# EAGLE design CH340E-noUSB (EAGLE 9.6.2)
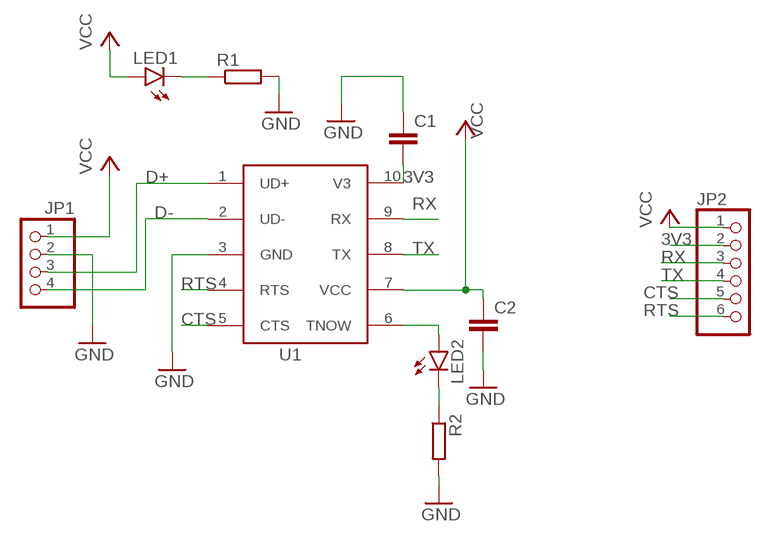
[diagram p0: schematic, sheet 1]

## Parts
C1  C-EUC0603  [C0603]
C2  C-EUC0603  [C0603]
JP1  PINHD-1X4  [1X04]
JP2  PINHD-1X6/90  [1X06/90]
LED1  LEDCHIP-LED0603  [CHIP-LED0603]
LED2  LEDCHIP-LED0603  [CHIP-LED0603]
R1  R-EU_R0603  [R0603]
R2  R-EU_R0603  [R0603]
U1  CH340ESMD  [MSOP10]

## Nets
3V3: C1.2 JP2.2 U1.10(V3)
CTS: JP2.5 U1.5(CTS)
D+: JP1.3 U1.1(UD+)
D-: JP1.4 U1.2(UD-)
GND: C1.1 C2.2 JP1.2 R1.2 R2.2 U1.3(GND)
N$2: LED1.C R1.1
N$3: LED2.A U1.6(TNOW)
N$4: LED2.C R2.1
RTS: JP2.6 U1.4(RTS)
RX: JP2.3 U1.9(RX)
TX: JP2.4 U1.8(TX)
VCC: C2.1 JP1.1 JP2.1 LED1.A U1.7(VCC)

## Library data of the parts
C1 C2 = rcl:C-EU: CAPACITOR, European symbol; SPICEPREFIX: C
JP1 = pinhead:PINHD-1X4: PIN HEADER
JP2 = pinhead:PINHD-1X6: PIN HEADER
LED1 LED2 = led:LED: LED OSRAM: - CHIPLED LG R971, LG N971, LY N971, LG Q971, LY Q971, LO R971, LY R971 LH N974, LH R974 LS Q976, LO Q976, LY Q976 LO Q996 - Hyper CHIPLED LW Q18S LB Q993, LB Q99A, LB R99A - SideLED LS A670, LO A670, LY A670, LG A670, LP A670 LB A673, LV A673, LT A673, LW A673 LH A674 LY A675 LS A676, LA A676, LO A676, LY A676, LW A676 LS A679, LY A679, LG A679 - Hyper Micro SIDELED® LS Y876, LA Y876, LO Y876, LY Y876 LT Y87S - SmartLED LW L88C, LW L88S LB L89C, LB L89S, LG L890 LS L89K, LO L89K, LY L89K LS L896, LA L896, LO L896, LY L896 - TOPLED LS T670, LO T670, LY T670, LG T670, LP T670 LSG T670, LSP T670, LSY T670, LOP T670, LYG T670 LG T671, LOG T671, LSG T671 LB T673, LV T673, LT T673, LW T673 LH T674 LS T676, LA T676, LO T676, LY T676, LB T676, LH T676, LSB T676, LW T676 LB T67C, LV T67C, LT T67C, LS T67K, LO T67K, LY T67K, LW E67C LS E67B, LA E67B, LO E67B, LY E67B, LB E67C, LV E67C, LT E67C LW T67C LS T679, LY T679, LG T679 LS T770, LO T770, LY T770, LG T770, LP T770 LB T773, LV T773, LT T773, LW T773 LH T774 LS E675, LA E675, LY E675, LS T675 LS T776, LA T776, LO T776, LY T776, LB T776 LHGB T686 LT T68C, LB T68C - Hyper Mini TOPLED® LB M676 - Mini TOPLED Santana® LG M470 LS M47K, LO M47K, LY M47K Source: http://www.osram.convergy.de LUXEON: - LUMILED® LXK2-PW12-R00, LXK2-PW12-S00, LXK2-PW14-U00, LXK2-PW14-V00 LXK2-PM12-R00, LXK2-PM12-S00, LXK2-PM14-U00 LXK2-PE12-Q00, LXK2-PE12-R00, LXK2-PE12-S00, LXK2-PE14-T00, LXK2-PE14-U00 LXK2-PB12-K00, LXK2-PB12-L00, LXK2-PB12-M00, LXK2-PB14-N00, LXK2-PB14-P00, LXK2-PB14-Q00 LXK2-PR12-L00, LXK2-PR12-M00, LXK2-PR14-Q00, LXK2-PR14-R00 LXK2-PD12-Q00, LXK2-PD12-R00, LXK2-PD12-S00 LXK2-PH12-R00, LXK2-PH12-S00 LXK2-PL12-P00, LXK2-PL12-Q00, LXK2-PL12-R00 Source: www.luxeon.com KINGBRIGHT: KA-3528ASYC Source: www.kingbright.com
R1 R2 = rcl:R-EU_: RESISTOR, European symbol; SPICEPREFIX: R
U1 = CH340E:CH340E: WCH.CN/CH340E See DataSheet： wch.cn <http://www.wch.cn/downloads/CH340DS1_PDF.html>

## Board
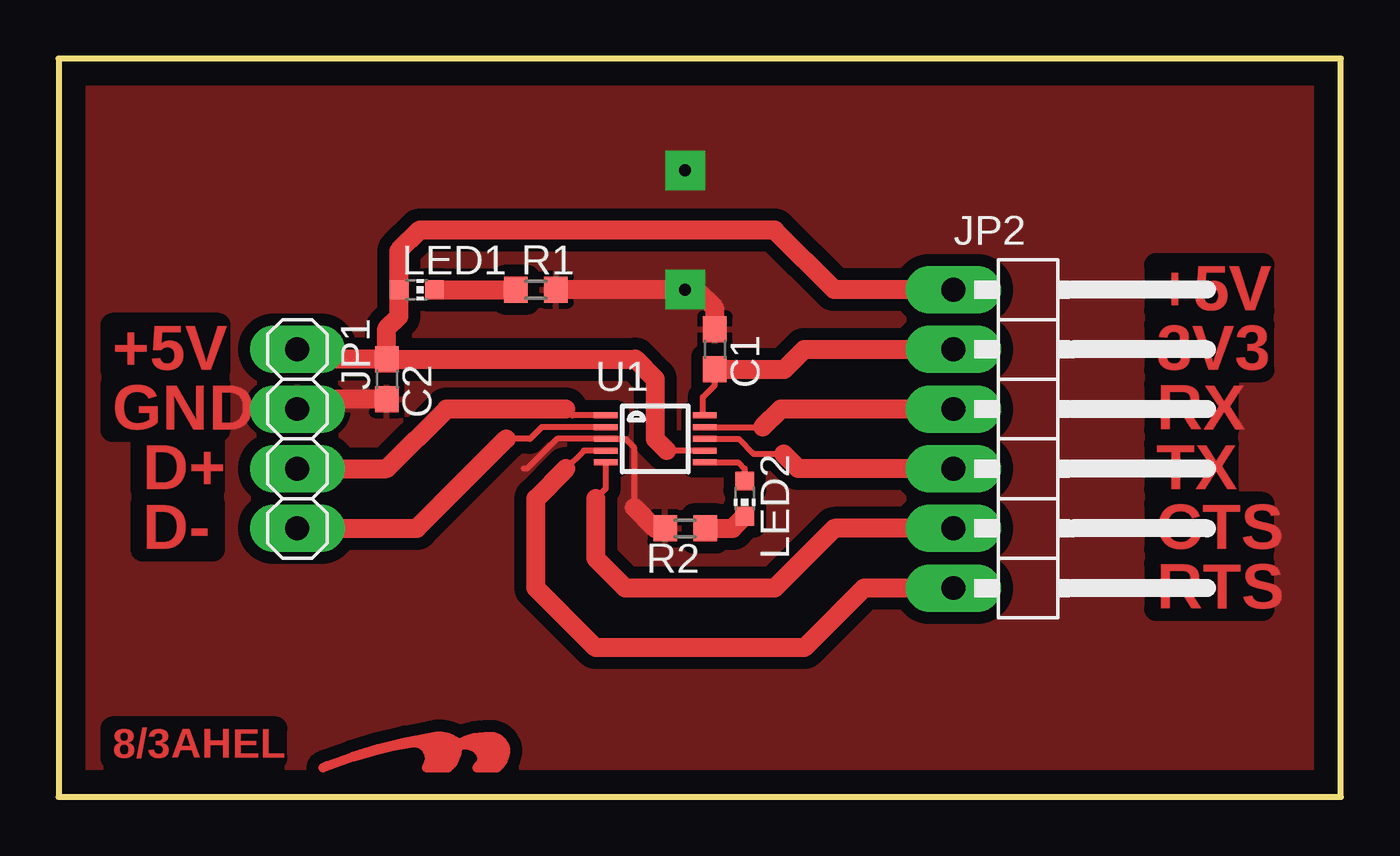
[diagram p1: board, top side]
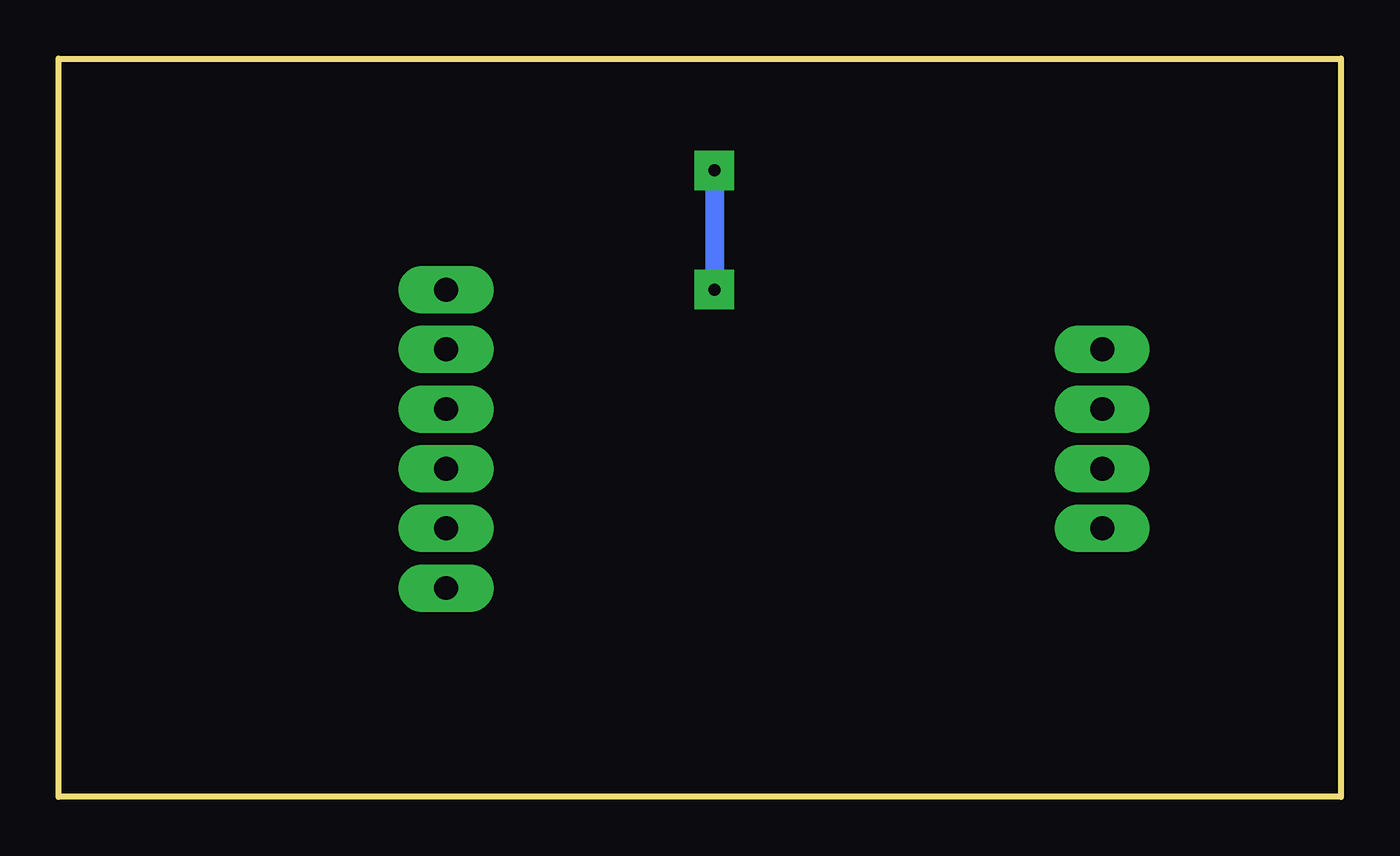
[diagram p2: board, bottom side, seen from below]

Size 54.59 x 31.42 mm. Coordinates in mm from the lower left corner, seen from the top.
Outline: 0,0 54.59,0 54.59,31.42 0,31.42 0,0
Copper layers (1*16): Top 0.035mm / dielectric 1.5mm / Bottom 0.035mm
Design rules "default *": minimum track width 6mil, minimum drill 0.35mm, track to track 16mil, track to pad 16mil, pad to pad 10mil, via to via 10mil, smd to smd 10mil, copper to edge 40mil, drill to drill 6mil, minimum pad ring 20mil, minimum via ring 8mil, stop-mask expansion 4mil, vias tented up to drill 0mil, thermal gap 10mil

### Footprints (pad centres in the part's own frame; a part is rotated, then mirrored left to right if it is on the bottom)
C0603 = smd 1.1 x 1: 1 -0.85,0; 2 0.85,0
1X04 = drill 1.016 long: 1 -3.81,0; 2 -1.27,0; 3 1.27,0; 4 3.81,0
1X06/90 = drill 1.016 long: 1 -6.35,-3.81; 2 -3.81,-3.81; 3 -1.27,-3.81; 4 1.27,-3.81; 5 3.81,-3.81; 6 6.35,-3.81
CHIP-LED0603 = smd 0.8 x 0.8: A 0,-0.75; C 0,0.75
R0603 = smd 1 x 1.1: 1 -0.85,0; 2 0.85,0
MSOP10 = smd 1 x 0.25: 1 -2.113,1; 2 -2.113,0.5; 3 -2.113,0; 4 -2.113,-0.5; 5 -2.113,-1; 6 2.113,-1; 7 2.113,-0.5; 8 2.113,0; 9 2.113,0.5; 10 2.113,1

### Placement (x,y rotation side)
C1  27.94,19.05 270 top
C2  13.97,17.78 270 top
JP1  10.16,15.24 270 top
JP2  41.91,15.24 270 top
LED1  15.24,21.59 270 top
LED2  29.21,12.7 180 top
R1  20.32,21.59 0 top
R2  26.67,11.43 180 top
U1  25.4,15.24 0 top
U$1  [LOGOTOP_8]  16.51,1.27 0 top

### Tracks (layer width: path | path; a pad name or v marks a point on that pad's centre or on a via)
3V3
  Top 0.254: U1.10 27.43,16.32 27.43,17.02 27.94,17.53 C1.2
  Top 0.813: C1.2 30.9,18.2 31.75,19.05 JP2.2
CTS
  Top 0.254: U1.5 23.29,13.13 22.86,12.7
  Top 0.813: JP2.5 33.02,11.43 30.48,8.89 24.13,8.89 22.86,10.16 22.86,12.7
D+
  Top 0.254: U1.1 21.86,16.24 21.59,16.51
  Top 0.813: JP1.3 13.97,13.97 16.51,16.51 21.59,16.51
D-
  Top 0.254: U1.2 20.57,15.74 20.07,15.24 19.05,15.24
  Top 0.813: 19.05,15.24 15.24,11.43 JP1.4
GND  (via drill 0.5 pad 1.68)
  Top 0.254: 24.51,12.32 24.51,14.86 24.13,15.24 U1.3 21.21,15.24 19.94,13.97 19.81,13.97
  Top 0.813: C2.2 11.85,16.93 11.43,16.51 JP1.2 | R2.2 25.4,11.43 24.51,12.32 | C1.1 27.94,20.79 27.14,21.59 v26.67,21.59 R1.2
  Bottom 0.813: v26.67,26.67 v26.67,21.59
  pour Top (isolate 0.508): 0,31.75 54.61,31.75 54.61,0 0,0
N$2
  Top 0.813: LED1.C R1.1
N$3
  Top 0.254: U1.6 28.94,14.24 29.21,13.97 LED2.A
N$4
  Top 0.813: R2.1 28.69,11.43 LED2.C
RTS
  Top 0.254: U1.4 22.36,14.74 21.59,13.97
  Top 0.813: 21.59,13.97 20.32,12.7 20.32,8.89 22.86,6.35 31.75,6.35 34.29,8.89 JP2.6
RX
  Top 0.254: U1.9 29.96,15.74 29.97,15.75
  Top 0.813: JP2.3 30.73,16.51 29.97,15.75
TX
  Top 0.254: U1.8 28.96,15.24 29.59,14.61 30.86,14.61
  Top 0.813: JP2.4 31.5,13.97 30.86,14.61
VCC
  Top 0.254: U1.7 25.9,14.74
  Top 0.813: C2.1 11.85,18.63 11.43,19.05 JP1.1 | C2.1 13.97,19.94 14.49,20.46 LED1.A 14.48,21.6 14.48,23.24 15.37,24.13 30.48,24.13 33.02,21.59 JP2.1 | 25.9,14.74 25.4,15.24 25.4,17.78 24.55,18.63 C2.1

### Text on the board
Top: +5V | +5V | +5V | 3V3 | GND | RX | D+ | TX | D- | CTS | RTS | 8/3AHEL